# EAGLE design Base_4node_V2.0 (EAGLE 9.6.2)
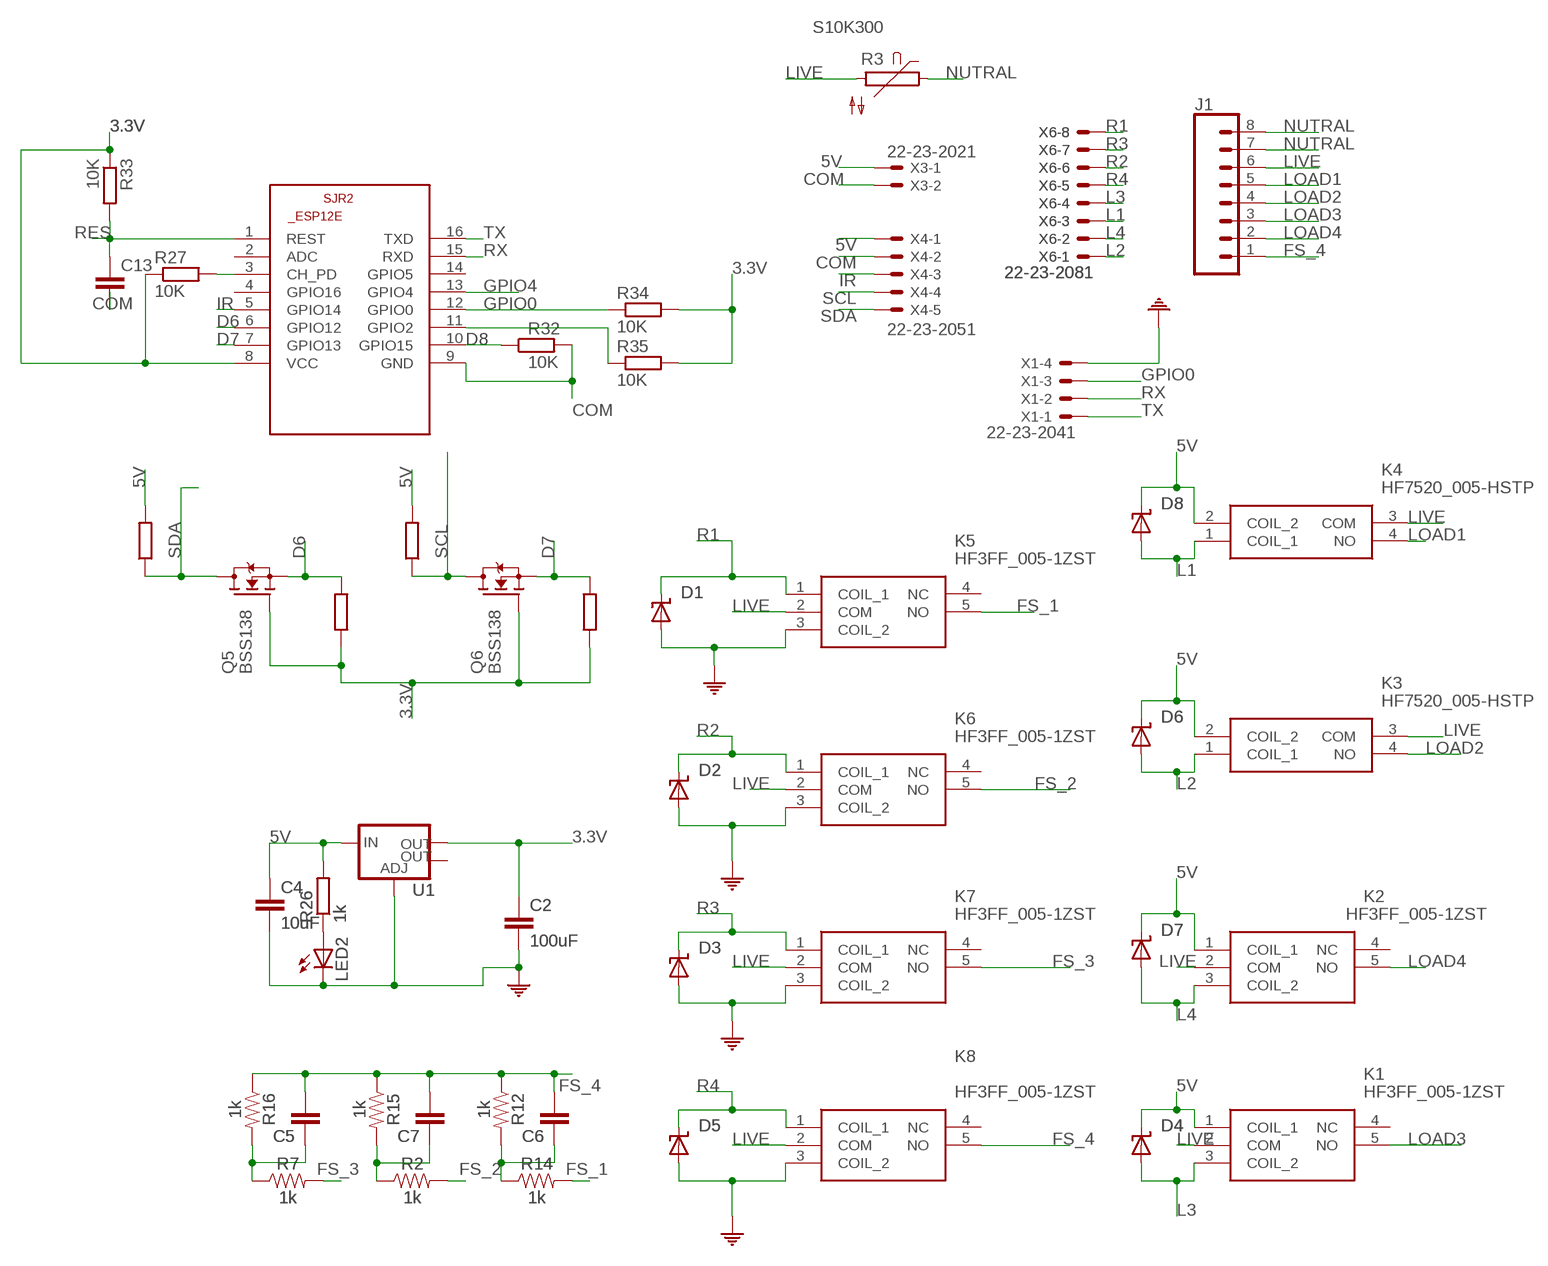
[diagram p0: schematic, sheet 1]

## Parts
C2  100uF  C-EUC1206  [C1206]
C4  10uF  C-EUC1206  [C1206]
C5  C-EU275-134X316  [C275-134X316]
C6  C-EU275-093X316  [C275-093X316]
C7  C-EU275-113X316  [C275-113X316]
C13  C-EUC0805  [C0805]
D1  SUPPRESSOR-SMBJ  [SMBJ]
D2  SUPPRESSOR-SMBJ  [SMBJ]
D3  SUPPRESSOR-SMBJ  [SMBJ]
D4  SUPPRESSOR-SMBJ  [SMBJ]
D5  SUPPRESSOR-SMBJ  [SMBJ]
D6  SUPPRESSOR-SMBJ  [SMBJ]
D7  SUPPRESSOR-SMBJ  [SMBJ]
D8  SUPPRESSOR-SMBJ  [SMBJ]
J1  CONN_083.5MM-8  [SCREWTERMINAL-3.5MM-8]
K1  HF3FF_005-1ZST  [HF3FF0051ZST]
K2  HF3FF_005-1ZST  [HF3FF0051ZST]
K3  HF7520_005-HSTP  [HF7520005HSTP]
K4  HF7520_005-HSTP  [HF7520005HSTP]
K5  HF3FF_005-1ZST  [HF3FF0051ZST]
K6  HF3FF_005-1ZST  [HF3FF0051ZST]
K7  HF3FF_005-1ZST  [HF3FF0051ZST]
K8  HF3FF_005-1ZST  [HF3FF0051ZST]
LED2  LEDCHIPLED_1206  [CHIPLED_1206]
Q5  BSS138  [SOT23]
Q6  BSS138  [SOT23]
R2  1k  1KOHM-VERT-1/4W-1%  [AXIAL-0.1]
R3  S10K300  [S10K300]
R7  1k  1KOHM-VERT-1/4W-1%  [AXIAL-0.1]
R12  1k  1KOHM-HORIZ-1/4W-1%  [AXIAL-0.3]
R14  1k  1KOHM-VERT-1/4W-1%  [AXIAL-0.1]
R15  1k  1KOHM-HORIZ-1/4W-1%  [AXIAL-0.3]
R16  1k  1KOHM-HORIZ-1/4W-1%  [AXIAL-0.3]
R26  1k  R-EU_R0805  [R0805]
R27  10K  R-EU_R0805  [R0805]
R32  10K  R-EU_R0805  [R0805]
R33  10K  R-EU_R0805  [R0805]
R34  10K  R-EU_R0805  [R0805]
R35  10K  R-EU_R0805  [R0805]
R36  10K  R-EU_R0805  [R0805]
R37  10K  R-EU_R0805  [R0805]
R38  10K  R-EU_R0805  [R0805]
R39  10K  R-EU_R0805  [R0805]
SJR2  ESP8266-12EESP12E  [ESP8266-ESP12E]
U1  V_REG_LM1117SOT223  [SOT223]
X1  22-23-2041  [22-23-2041]
X3  22-23-2021  [22-23-2021]
X4  22-23-2051  [22-23-2051]
X6  22-23-2081  [22-23-2081]

## Nets
3.3V: C2.1 Q5.1(G) Q6.1(G) R27.1 R33.1 R34.2 R35.2 R37.2 R39.2 SJR2.8(VCC) U1.2(OUT)
5V: C4.1 D4.C D6.C D7.C D8.C K1.1(COIL_1) K2.1(COIL_1) K3.2(COIL_2) K4.2(COIL_2) R26.2 R36.2 R38.2 U1.3(IN) X3.1 X4.1
COM: C2.2 C4.2 C13.2 D1.A D2.A D3.A D5.A K5.3(COIL_2) K6.3(COIL_2) K7.3(COIL_2) K8.3(COIL_2) LED2.C R32.2 SJR2.9(GND) U1.1(ADJ) X1.4 X3.2 X4.2
D6: Q5.2(S) R37.1 SJR2.6(GPIO12)
D7: Q6.2(S) R39.1 SJR2.7(GPIO13)
D8: R32.1 SJR2.10(GPIO15)
FS_1: K5.5(NO) R14.P$2
FS_2: K6.5(NO) R2.P$2
FS_3: K7.5(NO) R7.P$2
FS_4: C5.2 C6.2 C7.2 J1.1 K8.5(NO) R12.P$1 R15.P$1 R16.P$1
GPIO0: R34.1 SJR2.12(GPIO0) X1.3
GPIO4: SJR2.13(GPIO4)
IR: SJR2.5(GPIO14) X4.3
L1: D8.A K4.1(COIL_1) X6.3
L2: D6.A K3.1(COIL_1) X6.1
L3: D4.A K1.3(COIL_2) X6.4
L4: D7.A K2.3(COIL_2) X6.2
LIVE: J1.6 K1.2(COM) K2.2(COM) K3.3(COM) K4.3(COM) K5.2(COM) K6.2(COM) K7.2(COM) K8.2(COM) R3.2
LOAD1: J1.5 K4.4(NO)
LOAD2: J1.4 K3.4(NO)
LOAD3: J1.3 K1.5(NO)
LOAD4: J1.2 K2.5(NO)
N$1: C6.1 R12.P$2 R14.P$1
N$2: C7.1 R2.P$1 R15.P$2
N$3: C5.1 R7.P$1 R16.P$2
N$13: LED2.A R26.1
N$23: R35.1 SJR2.11(GPIO2)
N$27: R27.2 SJR2.3(CH_PD)
NUTRAL: J1.7 J1.8 R3.1
R1: D1.C K5.1(COIL_1) X6.8
R2: D2.C K6.1(COIL_1) X6.6
R3: D3.C K7.1(COIL_1) X6.7
R4: D5.C K8.1(COIL_1) X6.5
RES: C13.1 R33.2 SJR2.1(REST)
RX: SJR2.15(RXD) X1.2
SCL: Q6.3(D) R36.1 X4.4
SDA: Q5.3(D) R38.1 X4.5
TX: SJR2.16(TXD) X1.1
Unconnected: K1.4(NC) K2.4(NC) K5.4(NC) K6.4(NC) K7.4(NC) K8.4(NC) SJR2.2(ADC) SJR2.4(GPIO16) SJR2.14(GPIO5) U1.4(OUT)

## Library data of the parts
C2 C4 C5 = rcl:C-EU: CAPACITOR, European symbol; SPICEPREFIX: C
C6 C7 = rcl-2:C-EU: CAPACITOR, European symbol
C13 = rcl:C-EU: CAPACITOR, European symbol
D1-D8 = _mod_diode:SUPPRESSOR-: Suppressor diode
J1 = SparkFun-Connectors:CONN_08: Multi connection point. Often used as Generic Header-pin footprint for 0.1 inch spaced/style header connections On any of the 0.1 inch spaced packages, you can populate with these: Break Away Headers - Straight <https://www.sparkfun.com/products/116> (PRT-00116) Break Away Male Headers - Right Angle <https://www.sparkfun.com/products/553> (PRT-00553) Female Headers <https://www.sparkfun.com/products/115> (PRT-00115) Break Away Headers - Machine Pin <https://www.sparkfun.com/products/117> (PRT-00117) Break Away Female Headers - Swiss Machine Pin <https://www.sparkfun.com/products/743> (PRT-00743) Arduino Stackable Header - 8 Pin <https://www.sparkfun.com/products/9279> (PRT-09279) For SCREWTERMINALS and SPRING TERMINALS visit here: Screw Terimnals on SparkFun.com <https://www.sparkfun.com/search/results?term=Screw+Terminals> (5mm/3.5mm/2.54mm spacing) This device is also useful as a general connection point to wire up your design to another part of your project. Our various solder wires solder well into these plated through hole pads. Hook-Up Wire - Assortment (Stranded, 22 AWG) <https://www.sparkfun.com/products/11375> (PRT-11375) Hook-Up Wire - Assortment (Solid Core, 22 AWG) <https://www.sparkfun.com/products/11367> (PRT-11367) View the entire wire category on our website here <https://www.sparkfun.com/categories/141> Special notes: Molex polarized connector foot print use with SKU : PRT-08231 with associated crimp pins and housings. 1MM SMD Version SKU: PRT-10208 NOTES ON THE VARIANTS LOCK and LOCK_LONGPADS... This footprint was designed to help hold the alignment of a through-hole component (i.e. 6-pin header) while soldering it into place. You may notice that each hole has been shifted either up or down by 0.005 of an inch from it's more standard position (which is a perfectly straight line). This slight alteration caused the pins (the squares in the middle) to touch the edges of the holes. Because they are alternating, it causes a "brace" to hold the component in place. 0.005 has proven to be the perfect amount of "off-center" position when using our standard breakaway headers. Although looks a little odd when you look at the bare footprint, once you have a header in there, the alteration is very hard to notice. Also,if you push a header all the way into place, it is covered up entirely on the bottom side.
K1 K2 K5-K8 = HF3FF_005-1ZST:HF3FF_005-1ZST: SUBMINATURE HIGH POWER RELAY Source: Datasheet <http://www.hongfa.com/pro/pdf/HF3FF_en.pdf>; ARROW_PART_NUMBER: HF3FF/005-1ZST; DESCRIPTION: SUBMINATURE HIGH POWER RELAY; HEIGHT: 15mm; MANUFACTURER_NAME: Hongfa; MANUFACTURER_PART_NUMBER: HF3FF/005-1ZST
K3 K4 = HF7520_005-HSTP:HF7520_005-HSTP: Subminiature Power Relay, 1-Form-A, PCB Source: Datasheet <http://www.hongfa.com:8080/pdfjs/web/viewer.html?file=/Uploads/PDF/HF7520_en.pdf&stamp=1564134997314>; ARROW_PART_NUMBER: HF7520/005-HSTP; DESCRIPTION: Subminiature Power Relay, 1-Form-A, PCB; HEIGHT: 11.4mm; MANUFACTURER_NAME: Hongfa; MANUFACTURER_PART_NUMBER: HF7520/005-HSTP
LED2 = led:LED: LED OSRAM: - CHIPLED LG R971, LG N971, LY N971, LG Q971, LY Q971, LO R971, LY R971 LH N974, LH R974 LS Q976, LO Q976, LY Q976 LO Q996 - Hyper CHIPLED LW Q18S LB Q993, LB Q99A, LB R99A - SideLED LS A670, LO A670, LY A670, LG A670, LP A670 LB A673, LV A673, LT A673, LW A673 LH A674 LY A675 LS A676, LA A676, LO A676, LY A676, LW A676 LS A679, LY A679, LG A679 - Hyper Micro SIDELED® LS Y876, LA Y876, LO Y876, LY Y876 LT Y87S - SmartLED LW L88C, LW L88S LB L89C, LB L89S, LG L890 LS L89K, LO L89K, LY L89K LS L896, LA L896, LO L896, LY L896 - TOPLED LS T670, LO T670, LY T670, LG T670, LP T670 LSG T670, LSP T670, LSY T670, LOP T670, LYG T670 LG T671, LOG T671, LSG T671 LB T673, LV T673, LT T673, LW T673 LH T674 LS T676, LA T676, LO T676, LY T676, LB T676, LH T676, LSB T676, LW T676 LB T67C, LV T67C, LT T67C, LS T67K, LO T67K, LY T67K, LW E67C LS E67B, LA E67B, LO E67B, LY E67B, LB E67C, LV E67C, LT E67C LW T67C LS T679, LY T679, LG T679 LS T770, LO T770, LY T770, LG T770, LP T770 LB T773, LV T773, LT T773, LW T773 LH T774 LS E675, LA E675, LY E675, LS T675 LS T776, LA T776, LO T776, LY T776, LB T776 LHGB T686 LT T68C, LB T68C - Hyper Mini TOPLED® LB M676 - Mini TOPLED Santana® LG M470 LS M47K, LO M47K, LY M47K Source: http://www.osram.convergy.de LUXEON: - LUMILED® LXK2-PW12-R00, LXK2-PW12-S00, LXK2-PW14-U00, LXK2-PW14-V00 LXK2-PM12-R00, LXK2-PM12-S00, LXK2-PM14-U00 LXK2-PE12-Q00, LXK2-PE12-R00, LXK2-PE12-S00, LXK2-PE14-T00, LXK2-PE14-U00 LXK2-PB12-K00, LXK2-PB12-L00, LXK2-PB12-M00, LXK2-PB14-N00, LXK2-PB14-P00, LXK2-PB14-Q00 LXK2-PR12-L00, LXK2-PR12-M00, LXK2-PR14-Q00, LXK2-PR14-R00 LXK2-PD12-Q00, LXK2-PD12-R00, LXK2-PD12-S00 LXK2-PH12-R00, LXK2-PH12-S00 LXK2-PL12-P00, LXK2-PL12-Q00, LXK2-PL12-R00 Source: www.luxeon.com KINGBRIGHT: KA-3528ASYC Source: www.kingbright.com
Q5 Q6 = bss138_10:BSS138: BSS138 N-Channel Logic Level Enhancement Mode Field Effect Transistor Source: http://www.fairchildsemi.com/datasheets/BS/BSS138.pdf; MF: Fairchild; MPN: BSS138; OC_FARNELL: 9845330; OC_NEWARK: 67R2009
R2 R7 R14 = SparkFun-Resistors - Copy (2):1KOHM: 1kΩ resistor A resistor is a passive two-terminal electrical component that implements electrical resistance as a circuit element. Resistors act to reduce current flow, and, at the same time, act to lower voltage levels within circuits. - Wikipedia; PROD_ID: RES-12182
R3 = varistor:S10K300: VARISTOR
R12 R15 R16 = SparkFun-Resistors1:1KOHM: 1kΩ resistor A resistor is a passive two-terminal electrical component that implements electrical resistance as a circuit element. Resistors act to reduce current flow, and, at the same time, act to lower voltage levels within circuits. - Wikipedia; PROD_ID: RES-12182
R26 R27 R32-R39 = resistor:R-EU_: RESISTOR, European symbol
SJR2 = esp12e:ESP8266-12E: ESP8266-12E Library for Eagle CAD The author not responsible for any damages or errors!. Created by Suhail jr.lt;/author>
U1 = SparkFun-IC-Power:V_REG_LM1117: Voltage Regulator LM1117 Standard adjustable voltage regulator but in SMD form. Spark Fun Electronics SKU : COM-00595; PROD_ID: VREG-08170
X1 = con-molex-new white color :22-23-2041: .100" (2.54mm) Center Header - 4 Pin
X3 = con-molex-new white color :22-23-2021: .100" (2.54mm) Center Header - 2 Pin
X4 = con-molex-new white color :22-23-2051: .100" (2.54mm) Center Header - 5 Pin
X6 = con-molex-new white color :22-23-2081: .100" (2.54mm) Center Header - 8 Pin

## Board
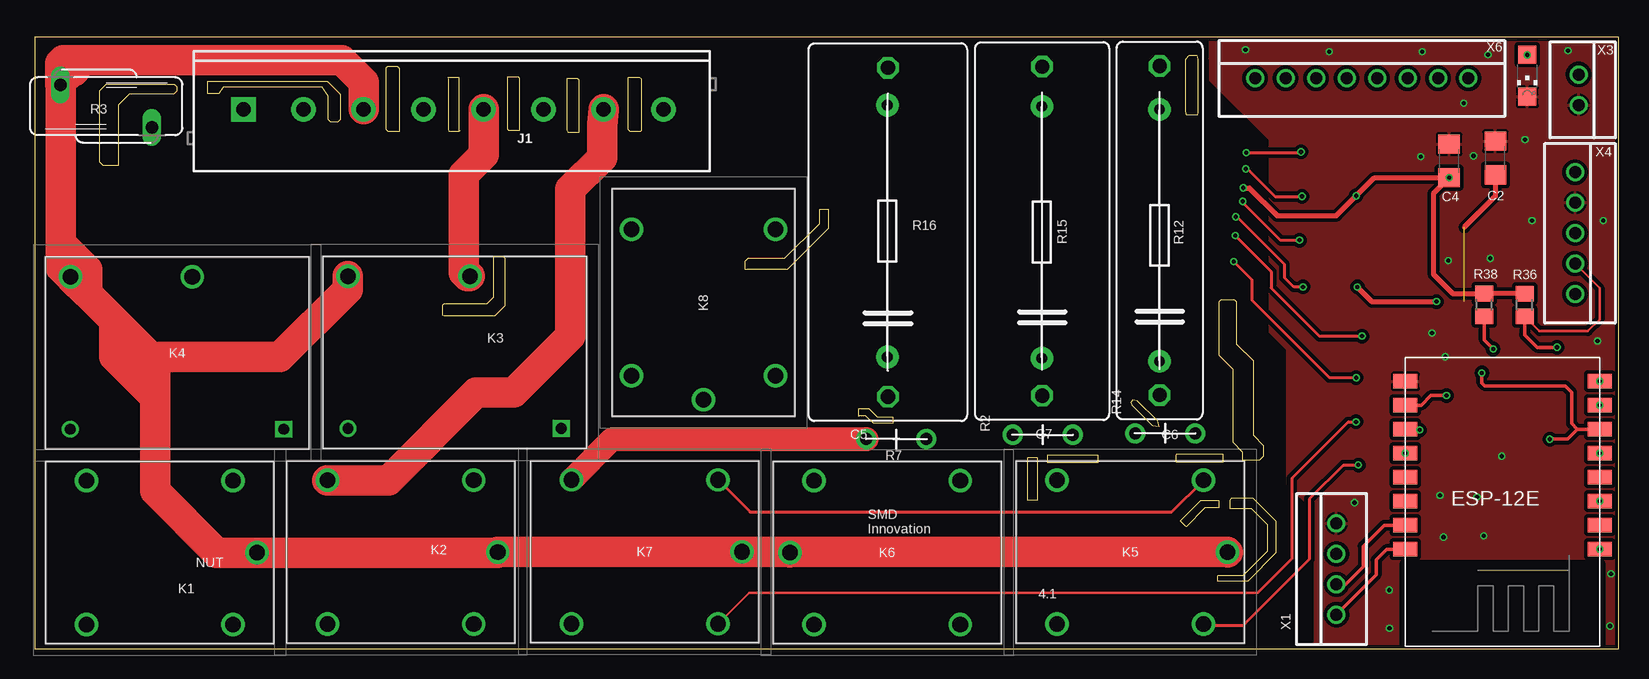
[diagram p1: board, top side]
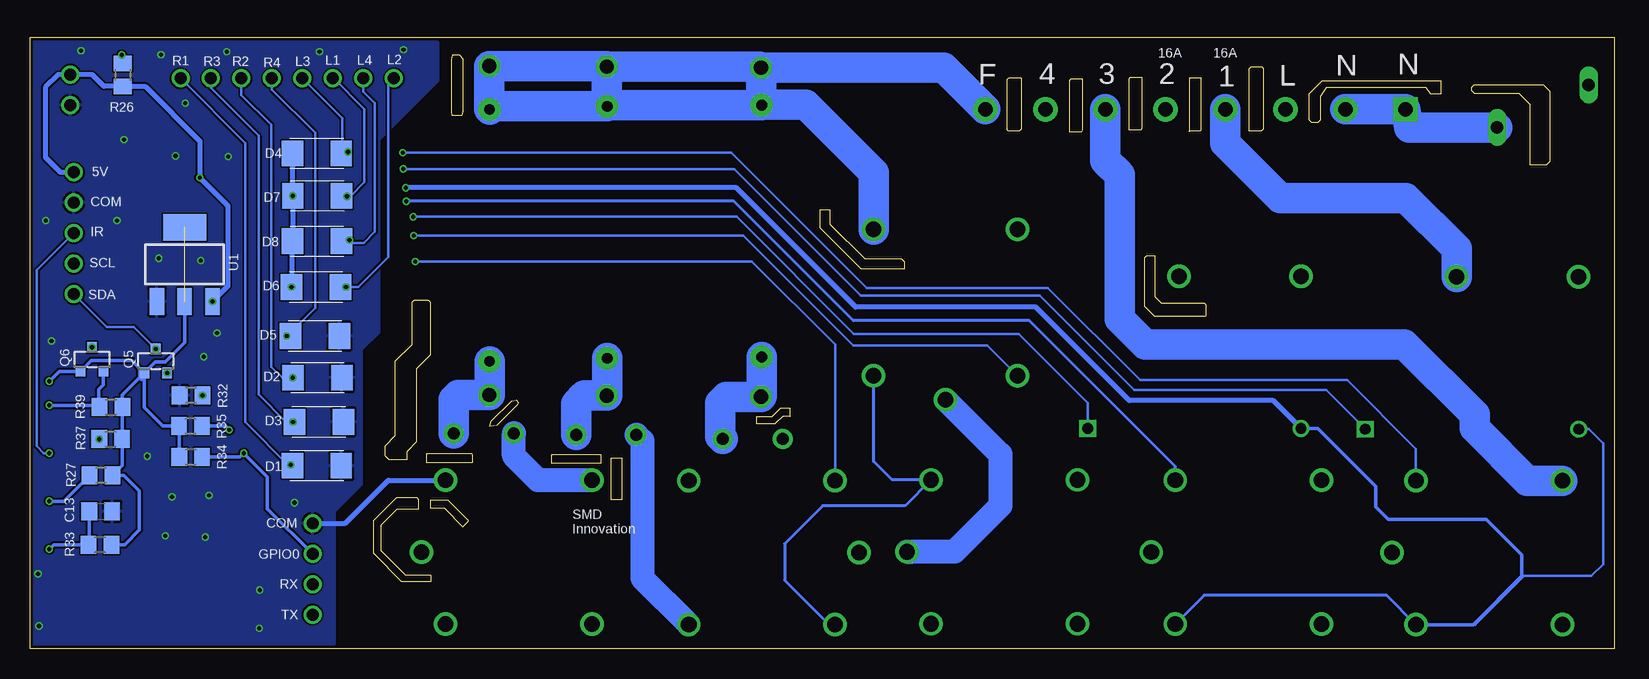
[diagram p2: board, bottom side, seen from below]

Size 132 x 51 mm. Coordinates in mm from the lower left corner, seen from the top.
Outline: 35.35,43.2 34.5,43.2 34.45,43.3 34.45,47.55 34.4,47.65 35.35,47.65 35.35,43.2
Outline: 35.45,43.2 35.35,43.2
Outline: 132,51 0,51 0,0 132,0 132,51
Outline: 11.65,47.05 5.9,47.05 5.35,46.5 5.35,40.65 5.65,40.35 7,40.35 7,45.4 7.9,46.3 11.6,46.3 11.85,46.55 11.85,46.85 11.65,47.05
Outline: 14.4,47.35 24.35,47.35 25.45,46.25 25.45,44.15 25.25,43.95 24.65,43.95 24.45,44.15 24.45,46.1 23.95,46.85 15.7,46.85 15.3,46.3 14.4,46.3 14.4,47.35
Outline: 29.25,48.45 29.25,43.35 29.4,43.2 30.4,43.2 30.4,48.4 30.25,48.55 29.35,48.55 29.25,48.45
Outline: 39.35,47.7 39.35,43.4 39.45,43.25 40.4,43.25 40.4,47.55 40.3,47.7 39.35,47.7
Outline: 44.3,47.55 44.3,43.25 44.4,43.1 45.35,43.1 45.35,47.45 45.25,47.55 44.3,47.55
Outline: 49.4,47.6 49.4,43.35 49.55,43.2 50.5,43.2 50.55,43.25 50.55,47.5 50.4,47.65 49.45,47.65 49.4,47.6
Outline: 96.2,49.5 96.8,49.5 96.9,49.2 96.9,44.75 96.85,44.5 96,44.5 95.9,44.8 95.9,49.2 96.2,49.5
Outline: 98.65,28.95 98.65,24.5 99.8,23.35 99.8,17.25 100.6,16.45 100.6,15.75 102.05,15.75 102.4,16.1 102.4,16.95 101.55,17.8 101.55,24 100.15,25.4 100.15,28.95 100,29.1 98.8,29.1 98.65,28.95
Outline: 99.6,11.7 99.6,12.45 99.75,12.6 101.5,12.6 103.4,10.7 103.4,8 101.05,5.65 98.55,5.65 98.55,6.1 98.6,6.15 100.7,6.15 102.75,8.2 102.75,10.35 101.4,11.7 99.6,11.7
Outline: 95.45,10.7 97.15,12.4 98.65,12.4 98.65,11.75 97.5,11.75 95.95,10.2 95.45,10.7
Outline: 95.15,16.25 99,16.25 99,15.55 95.15,15.55 95.1,15.6 95.1,16.2 95.15,16.25
Outline: 91.4,20.35 93.1,18.65 93.7,18.55 93.55,19 91.85,20.7 91.5,20.75 91.3,20.55 91.4,20.35
Outline: 84.4,16.2 88.55,16.2 88.55,15.5 84.4,15.5 84.4,16.2
Outline: 82.7,15.95 82.7,12.45 83.55,12.45 83.55,15.95 82.7,15.95
Outline: 68.65,20.05 69.5,20.05 70.2,19.35 71.5,19.35 71.5,18.8 69.9,18.8 69.25,19.45 68.7,19.45 68.65,19.4 68.65,20.05
Outline: 38.25,32.75 39,32.75 39.15,32.6 39.15,28.6 38.3,27.75 34.05,27.75 34,27.8 34,28.7 34.1,28.8 37.7,28.8 38.25,29.35 38.25,32.75
Outline: 59.15,31.7 62.75,31.7 66.15,35.1 66.15,36.65 65.4,36.65 65.35,36.6 65.35,35.45 62.45,32.55 59.4,32.55 59.15,32.3 59.15,31.7
Copper layers (1+16): Top 0.018mm / dielectric 1.55mm / Bottom 0.018mm
Design rules "eC_2Layer_PClass6_BaseCopperO18_eCDefault *": minimum track width 0.15mm, minimum drill 0.3mm, track to track 0.15mm, track to pad 0.15mm, pad to pad 0.15mm, via to via 0.15mm, smd to smd 0mil, copper to edge 0.25mm, drill to drill 0.35mm, minimum pad ring 0.175mm, minimum via ring 0.125mm, stop-mask expansion 0mil, vias tented up to drill 0.35mm, thermal gap 0.2mm

### Footprints (pad centres in the part's own frame; a part is rotated, then mirrored left to right if it is on the bottom)
C1206 = smd 1.6 x 1.8: 1 -1.4,0; 2 1.4,0
C275-134X316 = drill 1.194 octagon: 1 -13.716,0; 2 13.716,0
C275-093X316 = drill 1.194 octagon: 1 -13.716,0; 2 13.716,0
C275-113X316 = drill 1.194 octagon: 1 -13.716,0; 2 13.716,0
C0805 = smd 1.3 x 1.5: 1 -0.95,0; 2 0.95,0
SMBJ = smd 1.78 x 2.16: A 2.04,0; C -2.03,0
SCREWTERMINAL-3.5MM-8 = drill 1.2 pad 2.032: 1 0,0; 2 5,0; 3 10,0; 4 15,0; 5 20,0; 6 25,0; 7 30,0 | drill 1.2 pad 2.032 square: 8 35,0
HF3FF0051ZST = drill 1.3 pad 1.95: 1 -6.1,6; 2 -8.1,0; 3 -6.1,-6; 4 6.1,6; 5 6.1,-6
HF7520005HSTP = drill 0.9 pad 1.4 square: 1 0,0 | drill 0.9 pad 1.4: 2 -17.78,0 | drill 1.3 pad 1.95: 3 -17.78,12.7; 4 -7.62,12.7
CHIPLED_1206 = smd 1.5 x 1.5: A 0,-1.75; C 0,1.75
SOT23 = smd 0.8 x 0.9: 1 -0.95,-1; 2 0.95,-1; 3 0,1
AXIAL-0.1 = drill 1 pad 1.676: P$1 -2.5,0; P$2 2.5,0
S10K300 = drill 1.016 long: 1 -1.778,-3.81; 2 1.778,3.81
AXIAL-0.3 = drill 0.9 pad 1.88: P$1 -10.5,0; P$2 10.5,0
R0805 = smd 1.3 x 1.5: 1 -0.95,0; 2 0.95,0
ESP8266-ESP12E = smd 2 x 1.2: 1 -7.62,5.84; 2 -7.62,3.84; 3 -7.62,1.84; 4 -7.62,-0.16; 5 -7.62,-2.16; 6 -7.62,-4.16; 7 -7.62,-6.16; 8 -7.62,-8.16; 9 8.58,-8.16; 10 8.58,-6.16; 11 8.58,-4.16; 12 8.58,-2.16; 13 8.58,-0.16; 14 8.58,1.84; 15 8.58,3.84; 16 8.58,5.84
SOT223 = smd 1.219 x 2.235: 1 -2.311,-3.099; 2 0,-3.099; 3 2.311,-3.099 | smd 3.6 x 2.2: 4 0,3.099
22-23-2041 = drill 1: 1 -3.81,0; 2 -1.27,0; 3 1.27,0; 4 3.81,0
22-23-2021 = drill 1: 1 -1.27,0; 2 1.27,0
22-23-2051 = drill 1: 1 -5.08,0; 2 -2.54,0; 3 0,0; 4 2.54,0; 5 5.08,0
22-23-2081 = drill 1: 1 -8.89,0; 2 -6.35,0; 3 -3.81,0; 4 -1.27,0; 5 1.27,0; 6 3.81,0; 7 6.35,0; 8 8.89,0

### Placement (x,y rotation side)
C2  121.7,40.94 90 top
C4  117.85,40.71 90 top
C5  71.08,34.75 90 top
C6  93.72,34.89 90 top
C7  83.93,34.84 90 top
C13  126.11,11.47 0 bottom
D1  108.11,15.28 0 bottom
D2  108.05,22.62 0 bottom
D3  107.93,18.94 0 bottom
D4  108.1,41.32 0 bottom
D5  108.26,26.09 0 bottom
D6  108.17,30.18 0 bottom
D7  108.09,34 0 bottom
D8  108.07,37.79 0 bottom
J1  52.38,45 180 top
K1  10.41,8.03 180 top
K2  30.46,8.07 180 top
K3  43.86,18.38 0 top
K4  20.73,18.33 0 top
K5  91.28,8.08 180 top
K6  71.01,8.05 0 top
K7  50.82,8.1 180 top
K8  55.7,28.88 90 top
LED2  124.36,47.79 180 top
Q5  121.52,24.01 0 bottom
Q6  126.84,24.15 0 bottom
R2  83.97,17.87 180 top
R3  5.93,45.26 90 top
R7  71.78,17.5 180 top
R12  93.7,34.49 270 top
R14  94.18,17.98 180 top
R15  83.9,34.75 270 top
R16  71.03,34.85 270 top
R26  124.27,47.87 270 bottom
R27  126.08,14.48 180 bottom
R32  118.57,21.13 180 bottom
R33  126.17,8.69 180 bottom
R34  118.61,16 180 bottom
R35  118.63,18.58 180 bottom
R36  124.13,28.68 90 top
R37  125.28,17.5 0 bottom
R38  120.78,28.69 90 top
R39  125.26,20.16 0 bottom
SJR2  122.77,14.16 180 top
U1  119.11,32.06 0 bottom
X1  108.45,6.67 90 top
X3  128.63,46.64 270 top
X4  128.34,34.68 270 top
X6  110.57,47.58 0 top

### Tracks (layer width: path | path; a pad name or v marks a point on that pad's centre or on a via)
3.3V  (via drill 0.35)  (1 unrouted)
  Top 0.406: C2.1 121.7,37.75 119.11,35.16
  Bottom 0.305: 124.31,17.52 R39.2 124.31,21.18 122.89,22.6 | 124.31,17.52 R37.2 | 124.31,17.52 124.31,15.3 R27.1 124.17,14.48 122.89,13.2 122.89,9.92 124.12,8.69 R33.1 | R34.2 119.58,16.02 R35.2 120.94,18.58 122.49,20.13 122.49,22.46 | U1.2 119.11,25.56 120.74,23.93 121.55,23.93 Q5.1 | 122.84,23.38 123.52,24.06 126.89,24.06 Q6.1 129.56,23.15 SJR2.8 | 122.84,23.38 Q5.1 | Q5.1 122.84,22.65 | 122.84,22.65 122.89,22.6 | Q5.1 122.47,22.46 122.49,22.46 | 122.89,22.6 122.75,22.46 122.49,22.46 | 122.84,23.38 122.84,22.65
  other vias: 130.39,22.32
5V  (via drill 0.35)
  Top 0.406: v100.69,38.45 101.2,38.45 103.52,36.13 108.45,36.13 D8.C 111.62,39.3 C4.1 116.52,37.98 116.52,31.26 118.15,29.64 R38.2 R36.2 | D6.C 111.42,28.97 U1.3
  Bottom 0.203: K4.2 2.1,18.33 0.91,17.14 0.91,7.07 1.88,6.1 7.48,6.1 11.54,2.03 K1.1
  Bottom 0.254: K1.1 18.96,4.48 34.15,4.48 K2.1
  Bottom 0.305: K3.2 24.67,18.38 19.84,13.55 19.84,11.86 18.8,10.81 10.65,10.81 7.68,7.84 7.68,6.08 11.73,2.03 K1.1
  Bottom 0.406: K3.2 28.41,20.71 40.38,20.71 48.17,28.5 63.19,28.5 73.15,38.46 v100.69,38.46 v100.69,38.45 | D4.C 110.13,37.82 D8.C 110.1,34.02 D7.C 110.2,33.92 D6.C | X4.1 129.47,39.76 130.72,41 130.72,46.84 129.65,47.91 X3.1 126.82,47.91 125.83,46.92 R26.2 122.41,46.92 117.85,42.36 C4.1 115.5,36.96 115.5,30.26 U1.3
  other vias: 110.1,37.79 117.85,39.31 110.2,30.18 116.8,28.97
COM  (via drill 0.35)
  Top 0.254: K7.3 59.6,11.42 94.72,11.42 K5.3
  Bottom 0.254: K6.3 65.42,2.05 69.11,5.73 69.11,8.77 65.94,11.94 59.08,11.94 K7.3 60.16,14.1 61.7,15.64 K8.3
  Bottom 0.406: X1.4 105.74,10.48 102.14,14.08 K5.3
  other vias: 127.75,49.9 121.09,49.55 115.62,49.8 119.07,45.52 124.16,42.47 119.87,41.12 115.49,41.07 124.76,35.73 130.69,35.73 121.27,32.58 117.78,32.39 107.87,49.8 100.88,49.97 116.41,26.35 117.52,24.37 130.22,25.69 122.23,16.08 120.17,12.67 117.09,12.81 109.96,12.21 120.74,9.42 117.38,9.33 112.85,4.92 112.88,1.73 131.33,6.27 131.25,1.9
  pour Top (isolate 0.305): 131.46,50.88 131.86,50.48 131.86,0.2 131.77,0.11 106.87,0.11 106.59,0.39 106.59,11.45 104.31,13.74 104.31,24.92 102.84,26.38 102.84,42.47 97.9,47.41 97.84,50.9
  pour Bottom: 131.84,50.83 98.17,50.83 97.95,50.62 97.95,47.36 102.87,42.44 102.87,26.36 104.32,24.92 104.32,13.69 106.57,11.43 106.57,0.39 106.88,0.08 131.72,0.08 131.86,0.21
D6  (via drill 0.35)
  Top 0.305: Q5.2 120.57,22.2 120.82,21.94 127.51,21.94 128.05,21.4 128.05,18.8 128.53,18.32 SJR2.6 128.54,18.32 127.71,17.5 R37.1
  other vias: 120.57,23.01 126.23,17.5
D7  (via drill 0.35)
  Bottom 0.305: SJR2.7 126.36,20.32 R39.1 126.27,20.22 126.27,21.64 125.89,22.01 Q6.2
  other vias: 130.39,20.32
D8  (via drill 0.35)
  Top 0.305: R32.1 116.32,21.13 115.51,20.32 SJR2.10
  other vias: 117.62,21.13
FS_1
  Bottom 2: K5.5 89.65,14.08 91.68,16.11 R14.P$2
FS_2
  Bottom 2: K6.5 80.96,5.9 80.96,17.35 R2.P$2
FS_3
  Top 2: K7.5 48.12,17.5 R7.P$2
FS_4
  Bottom 2.54: C5.2 71.08,45.4 | 71.08,45.4 R16.P$1 83.86,45.35 83.93,45.27 | C7.2 83.93,45.27 | 83.93,45.27 R15.P$1 93.49,45.25 93.72,45.01 | 93.72,45.01 C6.2 83.98,48.61 C7.2 | 93.72,45.01 R12.P$1 | J1.1 55.84,48.47 C5.2 | C5.2 71.17,48.56 C7.2 | K8.5 61.7,39.72 67.37,45.4 71.08,45.4
GPIO0  (via drill 0.35)
  Bottom 0.305: R34.1 114.51,16 SJR2.12 112.22,14.34 112.22,11.7 X1.3
  other vias: 114.19,16.32
IR  (via drill 0.35)
  Bottom 0.203: X4.3 131.44,31.58 131.44,16.92 130.84,16.32 SJR2.5
  other vias: 130.39,16.32
L1  (via drill 0.35)
  Top 0.254: v100.89,40.03 101.06,40.03 103.35,37.74 v105.58,37.74
  Bottom 0.203: K4.1 23.98,21.58 39.96,21.58 47.84,29.47 62.77,29.47 73.33,40.03 v100.89,40.03 | X6.3 106.7,47.58 104.15,45.03 104.15,38.92 105.33,37.74 v105.58,37.74 105.99,37.74 D8.A
L2  (via drill 0.35)
  Top 0.254: v105.67,30.18 104.91,30.18 104.11,30.98 104.11,32.08 100.16,36.04 v100.07,36.04
  Bottom 0.203: K3.1 43.86,20.53 49.61,26.28 63.34,26.28 73.1,36.04 v100.07,36.04 | D6.A v105.67,30.18 104.65,30.18 102.15,32.68 102.15,47.11 X6.1
L3  (via drill 0.35)
  Top 0.254: v100.93,41.39 105.44,41.39 v105.5,41.45
  Bottom 0.203: K1.3 16.51,16.68 22.24,22.41 39.49,22.41 47.17,30.1 62.28,30.1 73.57,41.39 v100.93,41.39 | X6.4 105.98,44.26 105.98,41.41 D4.A
  Bottom 0.254: v105.5,41.45 105.94,41.45 D4.A
L4  (via drill 0.35)
  Top 0.254: v105.38,34.09 105.37,34.07 103.81,34.07 100.64,37.24 v100.64,37.32
  Bottom 0.203: X6.2 104.22,46.49 103.26,45.53 103.26,34.79 104.19,33.86 105.19,33.86 105.38,34.05 | D7.A 106,34.05 105.38,34.05 | v105.38,34.09 105.38,34.05
  Bottom 0.254: K2.3 36.56,15.21 48.73,27.38 63.39,27.38 73.38,37.37 100.59,37.37 v100.64,37.32
LIVE
  Top 2.54: R3.2 2.12,47.25 3.07,48.2 3.28,48.2 3.33,48.25 2.12,48.25 R3.2 | R3.2 2.12,48.86 2.35,49.08 25.56,49.08 27.38,47.26 J1.6 | R3.2 2.17,47 2.17,33.83 | 2.17,33.83 2.17,31.81 K4.3 4.34,29.64 | K3.3 26.08,29.99 20.41,24.33 9.65,24.33 | 9.65,24.33 10.01,23.97 10.01,20.97 | 4.34,29.64 6.59,27.39 | 6.59,27.39 9.65,24.33 | 10.01,20.97 10.01,13.19 15.16,8.03 K1.2 38.52,8.03 K2.2 38.58,8.1 K7.2 62.86,8.1 K6.2 62.95,8.09 99.36,8.09 K5.2 | 2.17,33.83 4.34,31.66 4.34,29.64 | 6.59,27.39 6.59,24.39 10.01,20.97
  Bottom 2: K8.2 51.14,16.23 51.14,11.95 54.96,8.13 58.39,8.13 58.43,8.1 K7.2
LOAD1
  Bottom 2.54: J1.5 32.38,42.18 27.81,37.62 17.34,37.62 13.11,33.39 K4.4
LOAD2
  Top 2.54: J1.4 37.38,41.22 35.73,39.58 35.73,31.37 36.03,31.08 K3.4
LOAD3
  Bottom 2.54: K1.5 7.21,14.03 11.6,18.42 11.6,19.54 17.46,25.41 39.08,25.41 41.2,27.53 41.2,39.56 42.38,40.74 J1.3
LOAD4
  Top 2.54: J1.2 47.25,43.66 47.25,40.98 44.61,38.34 44.61,26.09 39.91,21.39 36.78,21.39 29.46,14.07 K2.5
N$1
  Bottom 2.54: R12.P$2 93.7,21.2 C6.1 96.31,21.18 96.68,20.81 R14.P$1
N$2
  Bottom 2.54: R15.P$2 83.9,21.15 C7.1 85.8,21.13 86.47,20.45 R2.P$1
N$3
  Bottom 2.54: R16.P$2 71.03,21.08 C5.1 73.97,21.04 74.48,20.52 74.48,17.7 R7.P$1
N$13  (via drill 0.35)
  Bottom 0.406: R26.1 124.27,49.45 LED2.A
  other vias: 124.36,49.54
N$23  (via drill 0.35)
  Top 0.305: SJR2.11 115.33,18.32 v115.39,18.26
  Bottom 0.305: v115.39,18.26 115.7,18.58 R35.1
N$27  (via drill 0.35)
  Bottom 0.305: SJR2.3 129.19,12.32 R27.2
  other vias: 130.39,12.32
NUTRAL
  Bottom 2.54: R3.1 17.07,43.49 J1.8 J1.7
R1  (via drill 0.35)
  Top 0.254: K5.1 97.52,1.94 100.65,1.94 106.21,7.49 106.21,12.5 109.06,15.34 v110.28,15.34
  Bottom 0.203: X6.8 | X6.8 114.07,42.19 114.07,18.94 110.42,15.28 D1.C
  Bottom 0.254: v110.28,15.34 110.22,15.28 D1.C
R2  (via drill 0.35)
  Top 0.254: v99.9,32.31 101.41,30.8 101.41,29.08 107.87,22.62 v110.1,22.62
  Bottom 0.203: K6.1 64.91,25.39 71.84,32.33 99.9,32.33 v99.9,32.31 | X6.6 114.38,46.19 111.89,43.71 111.89,23.52 110.99,22.62 v110.1,22.62 D2.C
R3  (via drill 0.35)
  Top 0.203: K7.1 59.52,4.7 101.91,4.7
  Top 0.254: 101.91,4.7 104.74,7.52 104.74,14.23 109.45,18.94 v110.08,18.94
  Bottom 0.203: X6.7 116.92,46.79 112.95,42.82 112.95,21.21 110.68,18.94 v110.08,18.94 D3.C
R4  (via drill 0.35)
  Top 0.254: v100.02,34.46 103.02,31.47 103.02,30.11 107.06,26.06 110.56,26.06 v110.59,26.09
  Bottom 0.203: K8.1 52.21,25.29 63.39,25.29 72.56,34.46 v100.02,34.46 | X6.5 111.84,46.65 108.24,43.05 108.24,28.44 v110.59,26.09 D5.C
RES  (via drill 0.35)
  Bottom 0.305: C13.1 127.06,8.74 R33.2 130.03,8.69 SJR2.1
  other vias: 130.39,8.32
RX
  Top 0.305: SJR2.15 112.44,10.32 110.68,8.56 110.68,6.86 109.22,5.4 X1.2
SCL  (via drill 0.35)
  Top 0.203: X4.4 130.39,30.09 130.39,27.49 129.4,26.5 125.36,26.5 R36.1
  Top 0.305: R36.1 124.13,26.2 125.17,25.15 Q6.3
  other vias: 126.84,25.15
SDA  (via drill 0.35)
  Top 0.305: Q5.3 120.78,25.76 R38.1
  Bottom 0.203: X4.5 125.61,26.86 123.37,26.86 Q5.3
  other vias: 121.52,25.01
TX
  Top 0.305: X1.1 111.76,6.16 111.76,7.43 112.63,8.3 114.17,8.3 SJR2.16

### Text on the board
tNames: SMD / Innovation | NUT | 4.1
bNames: 16A | 16A | L2 | L4 | L1 | L3 | R2 | R3 | R1 | N | N | R4 | L | 1 | 2 | 3 | 4 | F | 5V | COM | IR | SCL | SDA | SMD / Innovation | COM | GPIO0 | RX | TX